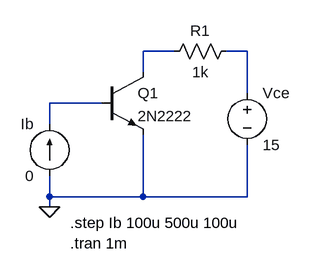
[diagram p0: schematic STEP Corrente de Base 2N2222.asc]
STEP Corrente de Base 2N2222.asc, the LTspice schematic file:
Version 4
SHEET 1 880 680
WIRE 272 48 224 48
WIRE 384 48 352 48
WIRE 224 80 224 48
WIRE 384 112 384 48
WIRE 160 128 80 128
WIRE 80 160 80 128
WIRE 80 272 80 240
WIRE 224 272 224 176
WIRE 224 272 80 272
WIRE 384 272 384 192
WIRE 384 272 224 272
WIRE 80 288 80 272
FLAG 80 288 0
SYMBOL current 80 240 R180
WINDOW 0 24 80 Left 2
WINDOW 3 24 0 Left 2
SYMATTR InstName Ib
SYMATTR Value 0
SYMBOL npn 160 80 R0
SYMATTR InstName Q1
SYMATTR Value 2N2222
SYMBOL voltage 384 96 R0
SYMATTR InstName Vce
SYMATTR Value 15
SYMBOL res 368 32 R90
WINDOW 0 0 56 VBottom 2
WINDOW 3 32 56 VTop 2
SYMATTR InstName R1
SYMATTR Value 1k
TEXT 112 344 Left 2 !.tran 1m
TEXT 112 312 Left 2 !.step Ib 100u 500u 100u

The netlist it stands for:
* STEP Corrente de Base 2N2222.asc
Ib 0 N003 0
Q1 N001 N003 0 0 2N2222
Vce N002 0 15
R1 N002 N001 1k
.model NPN NPN
.model PNP PNP
.lib standard.bjt
.tran 1m
.step Ib 100u 500u 100u
.backanno
.end